# EAGLE design ZigUP (EAGLE 6.5.0)
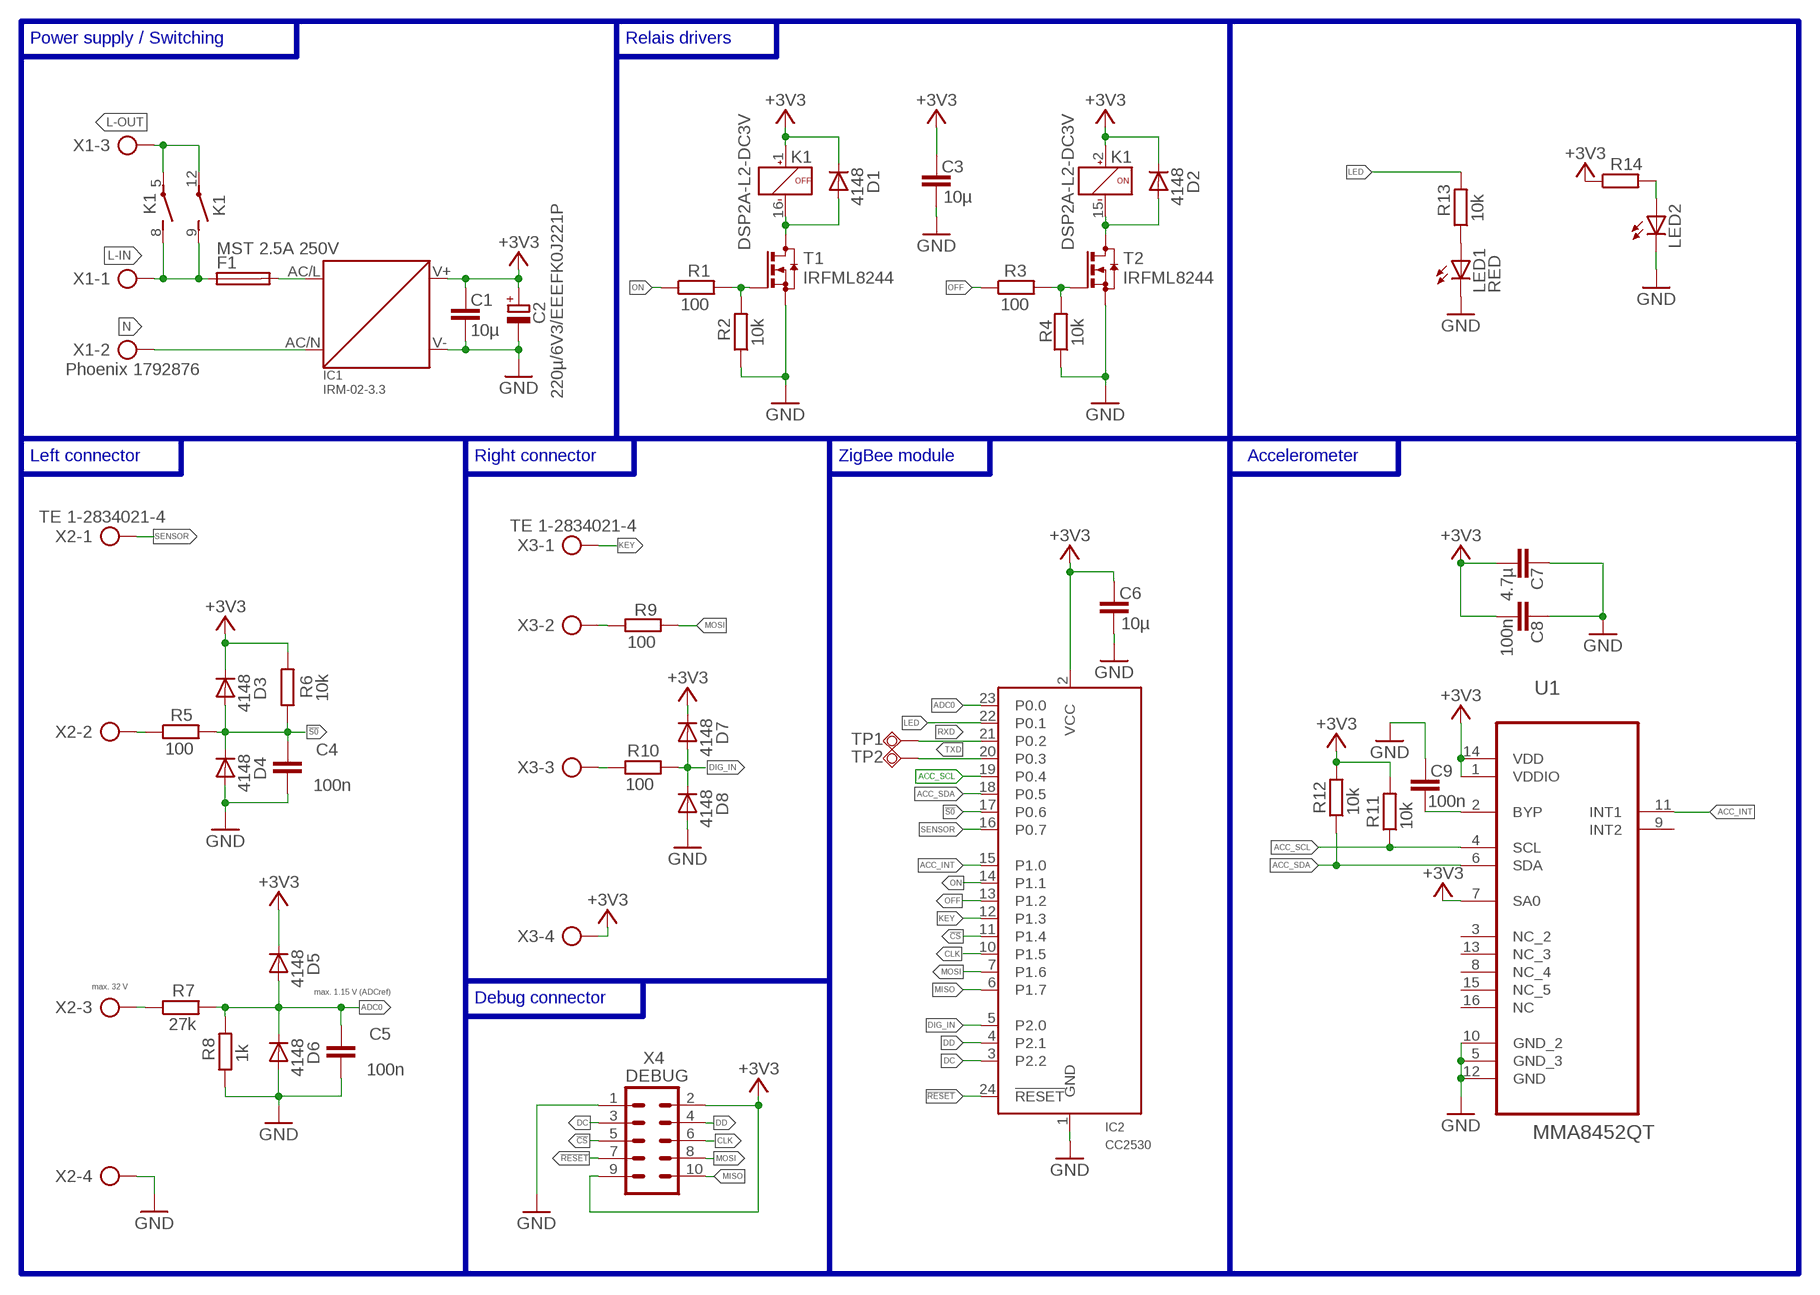
[diagram p0: schematic, sheet 1]

## Parts
C1  10µ  C-EUC0805  [C0805]
C2  220µ/6V3/EEEFK0J221P  CPOL-EUE2.5-6  [E2,5-6]
C3  10µ  C-EUC0805  [C0805]
C4  100n  C-EUC0805  [C0805]
C5  100n  C-EUC0805  [C0805]
C6  10µ  C-EUC0805  [C0805]
C7  4.7µ  C-EUC0805  [C0805]
C8  100n  C-EUC0805  [C0805]
C9  100n  C-EUC0805  [C0805]
D1  4148  TS4148  [1206]
D2  4148  TS4148  [1206]
D3  4148  TS4148  [1206]
D4  4148  TS4148  [1206]
D5  4148  TS4148  [1206]
D6  4148  TS4148  [1206]
D7  4148  TS4148  [1206]
D8  4148  TS4148  [1206]
F1  MST 2.5A 250V  MST  [MST]
IC1  IRM-02-3.3  IRM-01  [IRM-01]
IC2  CC2530  CC2530THT  [E18-MS1-PCB]
K1  DSP2A-L2-DC3V  DSP2A-L2  [DSP2A-L2]
LED1  RED  LED3MM  [LED3MM]
LED2  LEDSML0805  [SML0805]
R1  100  R-EU_R0805  [R0805]
R2  10k  R-EU_R0805  [R0805]
R3  100  R-EU_R0805  [R0805]
R4  10k  R-EU_R0805  [R0805]
R5  100  R-EU_R0805  [R0805]
R6  10k  R-EU_R0805  [R0805]
R7  27k  R-EU_R0805  [R0805]
R8  1k  R-EU_R0805  [R0805]
R9  100  R-EU_R0805  [R0805]
R10  100  R-EU_R0805  [R0805]
R11  10k  R-EU_R0805  [R0805]
R12  10k  R-EU_R0805  [R0805]
R13  10k  R-EU_R0805  [R0805]
R14  R-EU_R0805  [R0805]
T1  IRFML8244  BSS123  [SOT23]
T2  IRFML8244  BSS123  [SOT23]
TP1  RX  TPSQTP15SQ  [TP15SQ]
TP2  TX  TPSQTP15SQ  [TP15SQ]
U1  MMA8452QT  [QFN50P300X300X100-16N]
X1  Phoenix 1792876  PTS3  [PTS-3]
X2  TE 1-2834021-4  MSC4  [MSC4]
X3  TE 1-2834021-4  MSC4  [MSC4]
X4  DEBUG  MA05-2  [MA05-2]

## Nets
!CS: IC2.11(P1.4) X4.5
!RESET: IC2.24(!RESET) X4.7
!S0: C4.1 D3.A D4.K IC2.17(P0.6) R5.2 R6.1
+3V3: C1.1 C2.+ C3.1 C6.1 C7.2 C8.2 D1.K D2.K D3.K D5.K D7.K IC1.V+ IC2.2(VCC) K1.1(OFF:+) K1.2(ON:+) R6.2 R11.2 R12.2 R14.1 U1.1(VDDIO) U1.7(SA0) U1.14(VDD) X3.4 X4.2 X4.9
ACC_INT: IC2.15(P1.0) U1.11(INT1)
ACC_SCL: IC2.19(P0.4) R11.1 U1.4(SCL)
ACC_SDA: IC2.18(P0.5) R12.1 U1.6(SDA)
ADC0: C5.1 D5.A D6.K IC2.23(P0.0) R7.2 R8.2
CLK: IC2.10(P1.5) X4.6
DC: IC2.3(P2.2) X4.3
DD: IC2.4(P2.1) X4.4
DIG_IN: D7.A D8.K IC2.5(P2.0) R10.2
GND: C1.2 C2.- C3.2 C4.2 C5.2 C6.2 C7.1 C8.1 C9.1 D4.A D6.A D8.A IC1.V- IC2.1(GND) LED1.K(C) LED2.C R2.1 R4.1 R8.1 T1.2(S) T2.2(S) U1.5(GND_3) U1.10(GND_2) U1.12(GND) X2.4 X4.1
KEY: IC2.12(P1.3) X3.1
L-FUSED: F1.2 IC1.AC/L
L-IN: F1.1 K1.8(S1:C) K1.9(S2:C) X1.1
L-OUT: K1.5(S1:S) K1.12(S2:S) X1.3
LED: IC2.22(P0.1) R13.2
MISO: IC2.6(P1.7) X4.10
MOSI: IC2.7(P1.6) R9.1 X4.8
N: IC1.AC/N X1.2
N$1: C9.2 U1.2(BYP)
N$2: LED1.A R13.1
N$3: R7.1 X2.3
N$4: D2.A K1.15(ON:-) T2.3(D)
N$5: D1.A K1.16(OFF:-) T1.3(D)
N$6: R3.2 R4.2 T2.1(G)
N$7: R1.2 R2.2 T1.1(G)
N$8: R5.1 X2.2
N$9: LED2.A R14.2
N$10: R9.2 X3.2
N$12: R10.1 X3.3
OFF: IC2.13(P1.2) R3.1
ON: IC2.14(P1.1) R1.1
RXD: IC2.21(P0.2) TP1.TP
SENSOR: IC2.16(P0.7) X2.1
TXD: IC2.20(P0.3) TP2.TP
Unconnected: U1.3(NC_2) U1.8(NC_4) U1.9(INT2) U1.13(NC_3) U1.15(NC_5) U1.16(NC)

## Buses
B$1

## Notes on the sheet
- Power supply / Switching | Relais drivers
- Left connector | Right connector | ZigBee module | Accelerometer
- max. 32 V
- max. 1.15 V (ADCref)
- Debug connector

## Library data of the parts
C1 C3-C9 = rcl:C-EU: CAPACITOR, European symbol
C2 = rcl:CPOL-EU: POLARIZED CAPACITOR, European symbol
D1-D8 = Diode-1206:TS4148
F1 = Fuse_MST:MST
IC1 = IRM-01:IRM-01
IC2 = CC2530:CC2530
K1 = DSP2A-L2:DSP2A-L2
LED1 LED2 = led:LED: LED OSRAM: - CHIPLED LG R971, LG N971, LY N971, LG Q971, LY Q971, LO R971, LY R971 LH N974, LH R974 LS Q976, LO Q976, LY Q976 LO Q996 - Hyper CHIPLED LW Q18S LB Q993, LB Q99A, LB R99A - SideLED LS A670, LO A670, LY A670, LG A670, LP A670 LB A673, LV A673, LT A673, LW A673 LH A674 LY A675 LS A676, LA A676, LO A676, LY A676, LW A676 LS A679, LY A679, LG A679 - Hyper Micro SIDELED® LS Y876, LA Y876, LO Y876, LY Y876 LT Y87S - SmartLED LW L88C, LW L88S LB L89C, LB L89S, LG L890 LS L89K, LO L89K, LY L89K LS L896, LA L896, LO L896, LY L896 - TOPLED LS T670, LO T670, LY T670, LG T670, LP T670 LSG T670, LSP T670, LSY T670, LOP T670, LYG T670 LG T671, LOG T671, LSG T671 LB T673, LV T673, LT T673, LW T673 LH T674 LS T676, LA T676, LO T676, LY T676, LB T676, LH T676, LSB T676, LW T676 LB T67C, LV T67C, LT T67C, LS T67K, LO T67K, LY T67K, LW E67C LS E67B, LA E67B, LO E67B, LY E67B, LB E67C, LV E67C, LT E67C LW T67C LS T679, LY T679, LG T679 LS T770, LO T770, LY T770, LG T770, LP T770 LB T773, LV T773, LT T773, LW T773 LH T774 LS E675, LA E675, LY E675, LS T675 LS T776, LA T776, LO T776, LY T776, LB T776 LHGB T686 LT T68C, LB T68C - Hyper Mini TOPLED® LB M676 - Mini TOPLED Santana® LG M470 LS M47K, LO M47K, LY M47K Source: http://www.osram.convergy.de LUXEON: - LUMILED® LXK2-PW12-R00, LXK2-PW12-S00, LXK2-PW14-U00, LXK2-PW14-V00 LXK2-PM12-R00, LXK2-PM12-S00, LXK2-PM14-U00 LXK2-PE12-Q00, LXK2-PE12-R00, LXK2-PE12-S00, LXK2-PE14-T00, LXK2-PE14-U00 LXK2-PB12-K00, LXK2-PB12-L00, LXK2-PB12-M00, LXK2-PB14-N00, LXK2-PB14-P00, LXK2-PB14-Q00 LXK2-PR12-L00, LXK2-PR12-M00, LXK2-PR14-Q00, LXK2-PR14-R00 LXK2-PD12-Q00, LXK2-PD12-R00, LXK2-PD12-S00 LXK2-PH12-R00, LXK2-PH12-S00 LXK2-PL12-P00, LXK2-PL12-Q00, LXK2-PL12-R00 Source: www.luxeon.com KINGBRIGHT: KA-3528ASYC Source: www.kingbright.com
R1-R14 = rcl:R-EU_: RESISTOR, European symbol
T1 T2 = transistor-small-signal:BSS123: N-CHANNEL MOS FET
TP1 TP2 = testpad:TPSQ: Test pad
U1 = mma8452:MMA8452QT: 12-bit/8-bit Digital Accelerometer,QFN-16; MPN: MMA8452QT; OC_FARNELL: 1842360; OC_NEWARK: 84R7353; PACKAGE: QFN-16; SUPPLIER: FREESCALE SEMICONDUCTOR
X1 = Phoenix_PTS_5mm:PTS
X2 X3 = TE-MSC:MSC
X4 = con-lstb:MA05-2: PIN HEADER; OC_FARNELL: unknown; OC_NEWARK: unknown

## Board
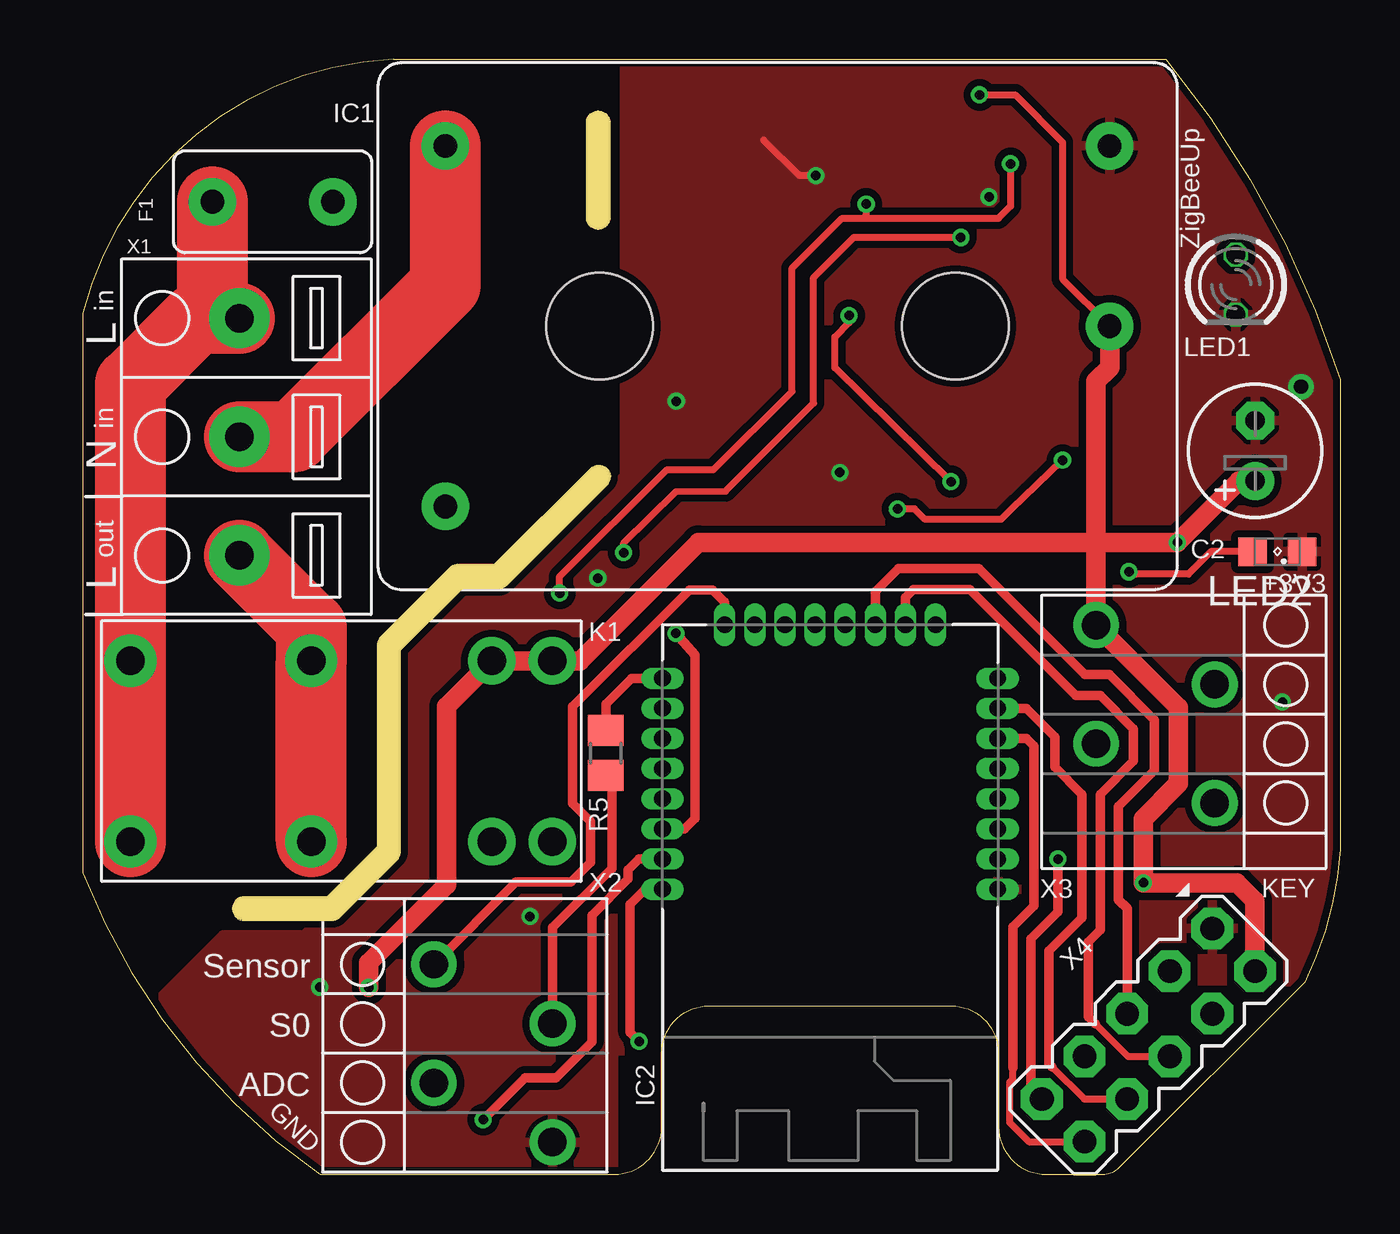
[diagram p1: board, top side]
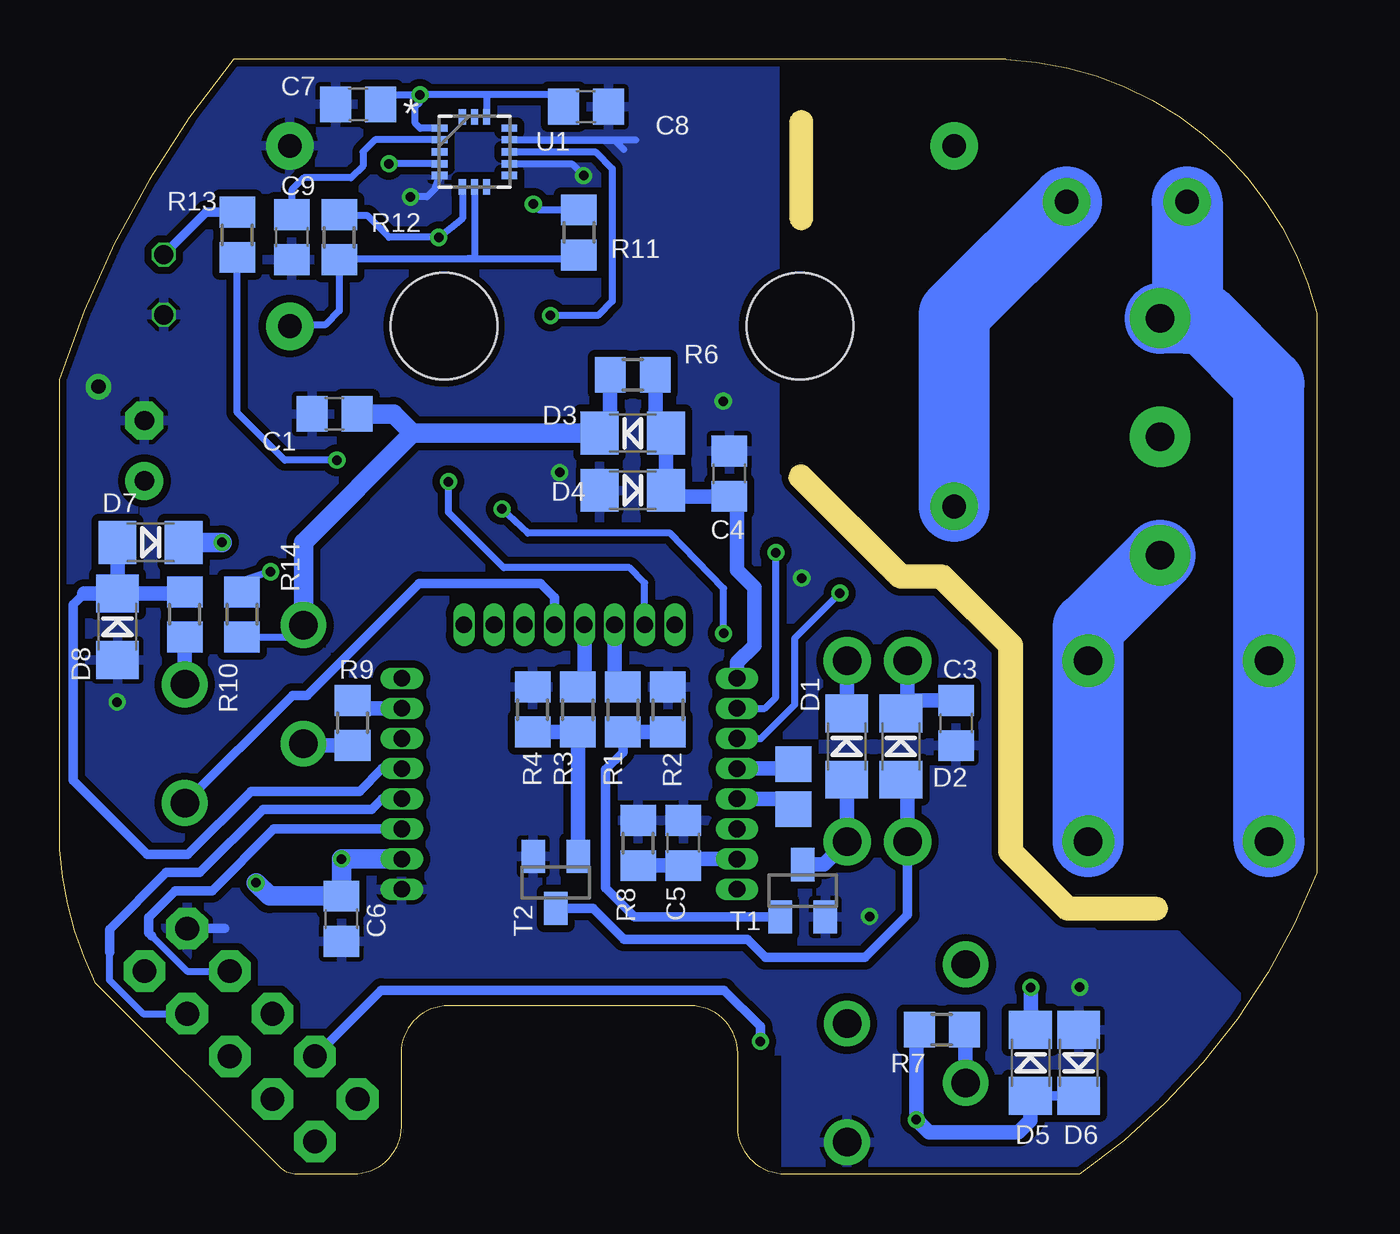
[diagram p2: board, bottom side, seen from below]

Size 53 x 47 mm. Coordinates in mm from the lower left corner, seen from the top.
Outline: 6.8,11.7 arc90 6.3,11.2 arc90 6.8,10.7 10.49,10.7 arc45 10.85,10.85 13.25,13.25 arc45 13.4,13.61 13.4,22.1 16,24.7 17.54,24.7 arc45 17.89,24.85 22.11,29.06 arc45 22.25,29.4 arc45 22.11,29.74 22.09,29.76 arc45 21.75,29.9 arc45 21.41,29.76 17.35,25.7 15.81,25.7 arc45 15.45,25.55 12.55,22.65 arc45 12.4,22.29 12.4,13.8 10.3,11.7 6.8,11.7
Outline: 10,0 22.4,0 arc90 24.4,2 24.4,5.1 arc-90 26.4,7.1 36.6,7.1 arc-90 38.6,5.1 38.6,2 arc90 40.6,0 42.99,0 arc45 43.69,0.29 51.5,8.1 arc23 53,13.7 53,33.5 arc22 45.65,47 13.1,47 arc73 0,36.3 0,12.7 arc34 10,0
Outline: 21.22,44.33 arc-90 21.72,44.83 arc-90 22.22,44.33 22.22,40.33 arc-90 21.72,39.83 arc-90 21.22,40.33 21.22,44.33
Copper layers (1*16): Top 0.035mm / dielectric 1.5mm / Bottom 0.035mm
Design rules "JLCPCB": minimum track width 5mil, minimum drill 0.3mm, track to track 5mil, track to pad 5mil, pad to pad 5mil, via to via 5mil, smd to smd 5mil, copper to edge 0.3mm, drill to drill 0.2mm, minimum pad ring 0.1mm, minimum via ring 0.15mm, stop-mask expansion 0.075mm, vias tented up to drill 0mil, thermal gap 0.2mm
Milling: 7 lines

### Footprints (pad centres in the part's own frame; a part is rotated, then mirrored left to right if it is on the bottom)
C0805 = smd 1.3 x 1.5: 1 -0.95,0; 2 0.95,0
E2,5-6 = drill 0.813 pad 1.6: + -1.27,0 | drill 0.813 pad 1.6 octagon: - 1.27,0
1206 = smd 1.6 x 1.8: A -1.4,0; K 1.4,0
MST = drill 1 pad 2: 1 -2.54,0; 2 2.54,0
IRM-01 = drill 1 pad 2: AC/L -14,-7.6; AC/N -14,7.6; V+ 14,0; V- 14,7.6 | hole 4.5: -7.5,0; 7.5,0
E18-MS1-PCB = drill 0.7 pad 0.9 long: 1 -0.35,7.065; 2 -1.62,7.065; 3 -2.89,7.065; 4 -4.16,7.065; 5 -5.43,7.065; 6 -6.7,7.065; 7 -7.97,7.065; 8 -9.24,7.065; 9 -11.5,4.445; 10 -11.5,3.175; 11 -11.5,1.905; 12 -11.5,0.635; 13 -11.5,-0.635; 14 -11.5,-1.905; 15 -11.5,-3.175; 16 -11.5,-4.445; 17 -9.24,-7.065; 18 -7.97,-7.065; 19 -6.7,-7.065; 20 -5.43,-7.065; 21 -4.16,-7.065; 22 -2.89,-7.065; 23 -1.62,-7.065; 24 -0.35,-7.065
DSP2A-L2 = drill 1.2 pad 2: 1 -8.89,-3.81; 2 -6.35,-3.81; 15 -6.35,3.81; 16 -8.89,3.81 | drill 1.2 pad 2.2: 5 1.27,-3.81; 8 8.89,-3.81; 9 8.89,3.81; 12 1.27,3.81
LED3MM = drill 0.813 octagon: A -1.27,0; K 1.27,0
SML0805 = smd 1.2 x 1.2: A 1.05,0; C -1.05,0
R0805 = smd 1.3 x 1.5: 1 -0.95,0; 2 0.95,0
SOT23 = smd 1 x 1.4: 1 -0.95,-1.1; 2 0.95,-1.1; 3 0,1.1
TP15SQ = smd 1.5 x 1.5: TP 0,0
QFN50P300X300X100-16N = smd 0.66 x 0.305: 1 -1.473,0.991; 2 -1.473,0.508; 3 -1.473,0; 4 -1.473,-0.508; 5 -1.473,-0.991; 9 1.473,-0.991; 10 1.473,-0.508; 11 1.473,0; 12 1.473,0.508; 13 1.473,0.991 | smd 0.305 x 0.66: 6 -0.508,-1.473; 7 0,-1.473; 8 0.508,-1.473; 14 0.508,1.473; 15 0,1.473; 16 -0.508,1.473
PTS-3 = drill 1.2 pad 2.54: 1 -5,0; 2 0,0; 3 5,0
MSC4 = drill 1.2 pad 1.93: 1 -3.75,-2.5; 2 -1.25,2.5; 3 1.25,-2.5; 4 3.75,2.5
MA05-2 = drill 1 pad 1.75 octagon: 1 -5.08,-1.27; 2 -5.08,1.27; 3 -2.54,-1.27; 4 -2.54,1.27; 5 0,-1.27; 6 0,1.27; 7 2.54,-1.27; 8 2.54,1.27; 9 5.08,-1.27; 10 5.08,1.27

### Placement (x,y rotation side)
C1  41.4,32.05 180 bottom
C2  49.42,30.5 90 top
C3  15.2,19.02 270 bottom
C4  24.76,29.53 90 bottom
C5  26.7,13.96 90 bottom
C6  41.1,10.78 270 bottom
C7  40.4,45.1 0 bottom
C8  30.8,45 180 bottom
C9  43.2,39.5 90 bottom
D1  19.81,18.03 90 bottom
D2  17.53,18.03 90 bottom
D3  28.83,31.24 180 bottom
D4  28.83,28.83 0 bottom
D5  12.06,4.7 90 bottom
D6  10.03,4.7 270 bottom
D7  49.15,26.64 0 bottom
D8  50.55,23.08 90 bottom
F1  8,41 0 top
IC1  29.29,35.75 0 top
IC2  31.5,11.67 270 top
K1  10.9,17.84 180 top
LED1  48.6,37.5 270 top
LED2  50.35,26.24 180 top
R1  29.25,19.59 270 bottom
R2  27.35,19.59 270 bottom
R3  31.15,19.59 270 bottom
R4  33.05,19.59 270 bottom
R5  22.05,17.76 90 top
R6  28.83,33.7 180 bottom
R7  15.8,6.1 180 bottom
R8  28.6,13.96 270 bottom
R9  40.64,19.03 270 bottom
R10  47.71,23.6 90 bottom
R11  31.1,39.7 270 bottom
R12  41.2,39.5 270 bottom
R13  45.5,39.6 270 bottom
R14  45.3,23.6 90 bottom
T1  21.66,11.95 0 bottom
T2  32.08,12.3 180 bottom
TP1  22.05,15.38 0 bottom
TP2  22.05,17.29 0 bottom
U1  35.5,43.1 0 bottom
X1  6.6,31.09 270 top
X2  17.3,5.1 270 top
X3  45.21,19.4 90 top
X4  44.92,5.87 225 top

### Tracks (layer width: path | path; a pad name or v marks a point on that pad's centre or on a via)
!CS
  Top 0.406: X4.5 44.02,11.2 43.65,11.57 43.65,15.51 45.17,17.03 45.17,19.16 43.26,21.06 42.25,21.06 37.77,25.54 34.37,25.54 33.41,24.57 IC2.11
!RESET  (via drill 0.4)
  Top 0.406: v23.45,5.6 23.07,5.99 23.07,11.39 23.7,12.02 IC2.24
  Bottom 0.406: X4.7 39.43,7.76 24.98,7.76 23.45,6.24 v23.45,5.6
!S0
  Top 0.406: IC2.17 23.14,20.91 22.05,19.82 R5.2
  Bottom 0.406: D4.K 27.88,28.38 | 27.88,31.69 D3.A
  Bottom 0.61: IC2.17 24.43,21.57 23.7,22.3 23.7,24.74 24.43,25.48 24.43,28.26 C4.1 27.18,28.58 D4.K D3.A | R6.1 27.88,31.69
+3V3  (via drill 0.4)
  Top 0.305: v37.8,45.5 39.3,45.5 41.3,43.5 41.3,37.74 IC1.V+
  Top 0.406: X4.9 39.96,3.64 39.96,9.92 41.1,11.06 v41.1,13.29
  Top 0.813: X4.2 49.41,11.53 48.64,12.29 v44.7,12.29 44.7,14.98 46.19,16.47 46.19,19.68 X3.4 42.71,26.67 | v12.05,7.88 12.05,8.92 15.33,12.19 15.33,19.73 K1.2 K1.1 20.96,21.65 25.95,26.64 42.64,26.64 42.67,26.67 42.76,26.67 42.8,26.64 | 42.8,26.64 v46.14,26.64 48.73,29.23 C2.+ | 42.8,26.64 42.75,26.64 42.71,26.67 | 42.71,26.67 42.71,33.44 43.29,34.02 IC1.V+
  Bottom 0.305: 39,45.5 39.6,45.3 C7.2 | 35,45.5 35,44.58 U1.14 | 43.24,35.7 IC1.V+ 43.24,35.8 41.8,35.8 41.2,36.4 R12.2 41.15,38.6 35.79,38.6 | U1.7 35.5,38.59 35.79,38.6 | 35.79,38.6 31.55,38.6 R11.2 | C8.2 31.8,44.6 32.3,45.5 35,45.5 | 35,45.5 v37.8,45.5 | 39,45.5 39.2,45.1 | v37.8,45.5 37.8,45.2 38,45 38,44.3 37.79,44.09 U1.1 | 39,45.5 v37.8,45.5 | R14.1 43.34,22.65 arc-45 43.12,22.74 X3.4
  Bottom 0.406: 19.79,19.46 D1.K | 17.25,19.71 D2.K | 29.78,31.69 D3.K | D5.K
  Bottom 0.61: K1.1 19.79,19.46 | K1.2 17.25,19.71 16.99,19.97 C3.1 | R6.2 29.78,31.69 | v12.05,7.88 D5.K
  Bottom 0.813: X3.4 42.71,26.64 38.1,31.24 | IC2.2 v41.1,13.29 C6.1 44.14,11.73 v44.7,12.29 | 38.1,31.24 D3.K | D7.K v46.14,26.64 | C1.1 38.92,32.05 38.1,31.24
ACC_INT  (via drill 0.4)
  Top 0.305: v32.3,36.2 32.3,35.9 31.7,35.3 31.7,34 v36.6,29.2
  Bottom 0.305: v32.3,36.2 30.3,36.2 29.7,36.8 29.7,42.4 30.4,43.1 U1.11 | IC2.15 28.32,24.93 28.97,25.57 34.27,25.57 36.6,27.9 v36.6,29.2
ACC_SCL  (via drill 0.4)
  Top 0.305: v20.1,24.5 20.1,25.2 24.63,29.7 26.58,29.7 29.9,33 29.9,38.2 32,40.3 32.92,40.3 | 32.92,40.3 38.6,40.3 39.1,40.8 v39.1,42.6 | v33.02,40.89 33.02,40.4 32.92,40.3
  Bottom 0.305: IC2.19 23.43,18.37 22,19.8 22,22.6 v20.1,24.5 | U1.4 v39.09,42.59 | v39.09,42.59 v39.11,42.59 v39.1,42.6 v39.09,42.59 | R11.1 32.78,40.65 v33.02,40.89
ACC_SDA  (via drill 0.4)
  Top 0.305: v22.8,26.2 22.8,26.6 25,28.78 27.1,28.8 30.8,32.5 30.8,37.8 32.5,39.5 36.82,39.5 v37.01,39.49
  Bottom 0.305: IC2.18 23.26,19.64 22.8,20.1 v22.8,26.2 | v37.01,39.49 37.2,39.5 39.1,39.5 40,40.4 41.15,40.4 R12.1 | U1.6 36.01,40.29 v37.01,39.49 | v37,39.5 v37.01,39.49
ADC0  (via drill 0.4)
  Top 0.406: v16.88,2.3 18.64,4.06 19.94,4.06 21.46,5.59 21.46,10.92 22.99,12.45 22.99,12.83 23.45,13.29 IC2.23
  Bottom 0.406: 26.68,13.04 C5.1 26.42,13.29 | D6.K D5.A
  Bottom 0.61: C5.1 R8.2 | IC2.23 26.42,13.29 | D5.A 12.06,2.29 12.57,1.78 16.35,1.78 v16.88,2.3 16.88,5.97 R7.2
CLK
  Top 0.305: 42.68,6.34 44.05,4.97 X4.6
  Top 0.406: 42.68,6.34 42.38,6.64 42.38,9.79 42.88,10.3 42.88,16.02 44.28,17.41 44.28,18.78 42.88,20.17 41.87,20.17 37.39,24.65 35.01,24.65 34.67,24.32 IC2.10
DC
  Bottom 0.305: 49.11,10.05 47.62,8.56 X4.3
  Bottom 0.406: 49.11,10.05 49.23,10.18 49.23,10.84 48.12,11.95 46.57,11.95 43.96,14.56 IC2.3
DD
  Bottom 0.305: X4.4 49.47,6.77 50.88,8.18 50.88,9.36
  Bottom 0.406: IC2.4 39.39,15.83 39.84,15.38 44.41,15.38 47.07,12.72 48.5,12.72 50.88,10.33 50.88,9.36
DIG_IN
  Bottom 0.406: IC2.5 39.39,17.1 40.34,16.14 44.91,16.14 47.58,13.48 49.29,13.48 52.41,16.6 52.41,24.01 51.94,24.48 | D8.K
  Bottom 0.61: 51.94,24.48 D8.K 47.78,24.48 R10.2 | D8.K D7.A
GND  (via drill 0.4, 0.6)
  Top 0.305: v30.9,42.1 30.2,42.1 28.7,43.6
  Bottom 0.305: U1.12 34.19,43.61 | 32.51,42.59 U1.10 31.39,42.59 v30.9,42.1 | U1.12 33.39,43.61 32.7,43.6 29.6,43.6 29.2,43.2 | U1.5 37.17,41.53 37.5,41.2 v38.2,41.2 | U1.12 28.71,43.61 28.7,43.6
  Bottom 0.406: X4.1 46.03,10.36
  other vias: 31.91,29.59 50.56,19.91 9.99,7.89 51.35,33.2 21.71,25.13 18.85,10.87 25.01,32.59
  pour Bottom (isolate 0.305): 22.36,5.2 22.36,-0.06 10.03,-0.13 7.37,2.03 5.21,4.19 3.43,6.48 2.99,7.2 3,7.2 5.9,10.1 9.3,10.1 12.9,13.6 12.9,22.3 15.8,25.2 18.56,25.2 22.83,29.46 22.83,46.99 45.59,46.99 47.37,44.83 49.28,41.91 50.93,38.86 52.32,35.43 53.09,33.53 53.1,13.5 52.5,10.3 51.5,8.1 48.7,5.2
  pour Top (isolate 0.305): 22.36,5.2 22.36,-0.06 10.03,-0.13 7.37,2.03 5.21,4.19 3.43,6.48 2.99,7.2 3,7.2 5.9,10.1 9.3,10.1 12.9,13.6 12.9,22.3 15.8,25.2 18.56,25.2 22.83,29.46 22.83,46.99 45.59,46.99 47.37,44.83 49.28,41.91 50.93,38.86 52.32,35.43 53.09,33.53 53.09,13.99 53.1,13.9 52.9,12.3 52.5,10.4 51.5,8.1 48.7,5.2
KEY
  Bottom 0.406: IC2.12 32.13,24.32 32.72,24.91 37.83,24.91 42.55,20.19 43.17,20.19 X3.1
L-FUSED
  Bottom 3: F1.2 15.29,36.25 IC1.AC/L
L-IN
  Top 2: X1.1 6.6,36.19
  Top 3: K1.9 K1.8 2.01,33.31 4.78,36.09 X1.1 5.46,36.09 F1.1
  Bottom 2: X1.1 6.6,36.19
  Bottom 3: K1.9 2.01,33.31 4.78,36.09 5.46,36.09 | F1.1 5.46,36.09 | 5.46,36.09 X1.1
L-OUT
  Top 3: K1.12 K1.5 9.63,23.06 X1.3
  Bottom 3: K1.12 9.63,23.06 X1.3
LED  (via drill 0.4)
  Top 0.305: v41.3,30.1 39.14,28.04 38.7,27.6 35.5,27.6 35.06,28.04 v34.34,28.04
  Top 0.406: IC2.22 25.36,14.56 25.8,15 25.8,21.9 v25,22.8
  Bottom 0.305: v25,22.8 25,24.7 27.25,27.03 33.25,27.03 v34.34,28.04 | v41.3,30.1 43.5,30.1 45.5,32.1 R13.2
MISO
  Top 0.305: X4.10 39.87,1.38 39.07,2.17 39.07,3.89 39.2,4.02 39.2,4.49
  Top 0.406: IC2.6 39.77,18.37 40.09,18.05 40.09,11.32 39.2,10.43 39.2,4.49
MOSI
  Top 0.305: 40.85,4.54 42.21,3.17 X4.8
  Top 0.406: 40.85,4.54 40.72,4.66 40.72,9.41 42.12,10.81 42.12,16.02 40.98,17.16 40.98,18.43 39.77,19.64 IC2.7
  Bottom 0.61: IC2.7 40.3,19.64 R9.1
N
  Top 3: X1.2 8.89,31.09 15.29,37.49 IC1.AC/N
N$1
  Bottom 0.305: C9.2 43.2,41.5 42.7,42 40.7,42 40.2,42.5 40.2,43.1 39.69,43.61 U1.2
N$2
  Bottom 0.406: R13.1 46.82,40.55 LED1.A
N$3
  Bottom 0.406: 14.8,6.05 R7.1
  Bottom 0.61: X2.3 14.8,6.05
N$4
  Bottom 0.406: 17.25,16.36 D2.A | K1.15 17.25,10.94 19.05,9.14 23.24,9.14 24,9.91 29.21,9.91 30.5,11.21 T2.3
  Bottom 0.61: K1.15 17.25,16.36
N$5
  Bottom 0.406: 19.79,16.61 D1.A
  Bottom 0.61: 19.79,16.61 K1.16 20.76,13.05 T1.3
N$6
  Bottom 0.406: 31.13,18.82 R3.2
  Bottom 0.61: R4.2 R3.2 | T2.1 31.13,18.82
N$7
  Bottom 0.406: R1.2 29.25,17.79 29.97,17.06 29.97,12.07 28.76,10.85 T1.1
  Bottom 0.61: R1.2 R2.2
N$8
  Top 0.406: R5.1 22.3,16.55 22.3,12.9 19.8,10.4 X2.2
N$9  (via drill 0.4)
  Top 0.305: LED2.A 47.54,26.24 46.6,25.3 44.4,25.3 v44.1,25.4
  Bottom 0.305: v44.1,25.4 45.05,25.1 R14.2
N$10
  Bottom 0.61: R9.2 42.64,18.08 X3.2
N$12
  Bottom 0.61: X3.3 R10.1
OFF
  Bottom 0.61: IC2.13 30.86,21.02 R3.1
ON
  Bottom 0.61: IC2.14 29.59,21.09 R1.1
RXD
  Bottom 0.61: IC2.21 22.5,15.83 TP1.TP
SENSOR
  Top 0.406: IC2.16 27.05,24.13 26.54,24.64 25.57,24.64 20.65,19.71 20.65,15.64 21.4,14.88 21.4,13.14 20.57,12.32 18.27,12.32 X2.1
TXD
  Bottom 0.61: IC2.20 22.24,17.1 TP2.TP

### Text on the board
tPlace: ZigBeeUp | in | L | in | N | out | L | +3V3 | KEY | Sensor | S0 | ADC | GND
tValues: 2.5A | 220µ
tDocu: DIG | LED